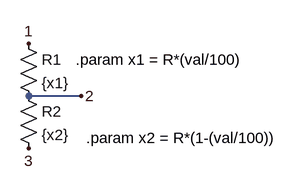
[diagram p0: schematic Draft1.asc]
Draft1.asc, the LTspice schematic file:
Version 4
SHEET 1 880 680
WIRE 240 144 160 144
FLAG 160 64 1
FLAG 240 144 2
FLAG 160 224 3
SYMBOL res 144 48 R0
SYMATTR InstName R1
SYMATTR Value {x1}
SYMBOL res 144 128 R0
SYMATTR InstName R2
SYMATTR Value {x2}
TEXT 232 88 Left 2 !.param x1 = R*(val/100)
TEXT 248 208 Left 2 !.param x2 = R*(1-(val/100))

The netlist it stands for:
* Draft1.asc
R1 1 2 {x1}
R2 2 3 {x2}
.param x1 = R*(val/100)
.param x2 = R*(1-(val/100))
.backanno
.end